# EAGLE design SleepLiteRev3 (EAGLE 6.2)
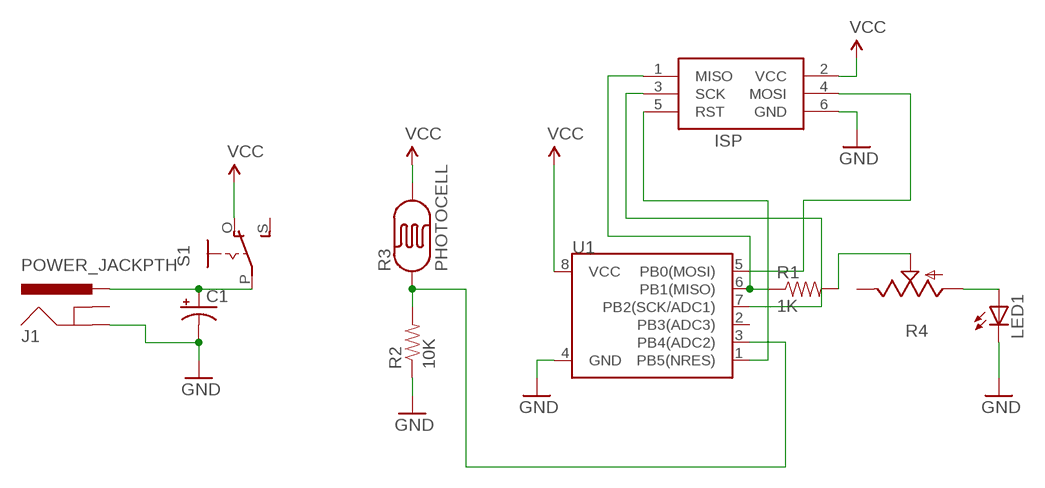
[diagram p0: schematic, sheet 1]

## Parts
C1  CAP_POLPTH2  [CPOL-RADIAL-10UF-25V]
ISP  AVRISP-6  [AVRISP]
J1  POWER_JACKPTH  [POWER_JACK_PTH]
LED1  LED5MM  [LED5MM]
R1  1K  RESISTORPTH-1/4W  [AXIAL-0.4]
R2  10K  RESISTORPTH-1/4W  [AXIAL-0.4]
R3  PHOTOCELL  PHOTOCELLPTH-KIT  [PHOTOCELL-KIT]
R4  TRIM_US-B64Y  [B64Y]
S1  EG1218S  [EG1218]
U1  ATTINY13DIP  [DIP08]

## Nets
GND: C1.2(-) ISP.6(GND) J1.GND LED1.K(C) R2.P$1 U1.4(GND)
N$1: C1.1(+) J1.PWR S1.P
N$2: R2.P$2 R3.1 U1.3(PB4(ADC2))
N$3: ISP.1(MISO) R1.P$1 U1.6(PB1(MISO))
N$4: R1.P$2 R4.S
N$5: LED1.A R4.A
N$6: ISP.5(RST) U1.1(PB5(NRES))
N$7: ISP.4(MOSI) U1.5(PB0(MOSI))
N$9: ISP.3(SCK) U1.7(PB2(SCK/ADC1))
VCC: ISP.2(VCC) R3.2 S1.O U1.8(VCC)
Unconnected: J1.GNDBREAK R4.E S1.S U1.2(PB3(ADC3))

## Library data of the parts
C1 = SparkFun-Passives:CAP_POL: Capacitor Polarized These are standard SMD and PTH capacitors. Normally 10uF, 47uF, and 100uF in electrolytic and tantalum varieties. Always verify the external diameter of the through hole cap, it varies with capacity, voltage, and manufacturer. The EIA devices should be standard.
ISP = adafruit:AVRISP: AVR ISP HEADER Standard 6 pin header for AVR programming
J1 = SparkFun-Connectors:POWER_JACK: Power Jack This is the standard 5.5mm barrel jack for power. The PTH is the most common, proven, reliable, footprint. All others are experimental. The Slot footprint only works if the mill layer is transmitted to the PCB fab house so be warned. Spark Fun Electronics SKU : PRT-00119. Mating wall wart : TOL-00298 (and others)
LED1 = led:LED: LED OSRAM: - CHIPLED LG R971, LG N971, LY N971, LG Q971, LY Q971, LO R971, LY R971 LH N974, LH R974 LS Q976, LO Q976, LY Q976 LO Q996 - Hyper CHIPLED LW Q18S LB Q993, LB Q99A, LB R99A - SideLED LS A670, LO A670, LY A670, LG A670, LP A670 LB A673, LV A673, LT A673, LW A673 LH A674 LY A675 LS A676, LA A676, LO A676, LY A676, LW A676 LS A679, LY A679, LG A679 - Hyper Micro SIDELED® LS Y876, LA Y876, LO Y876, LY Y876 LT Y87S - SmartLED LW L88C, LW L88S LB L89C, LB L89S, LG L890 LS L89K, LO L89K, LY L89K LS L896, LA L896, LO L896, LY L896 - TOPLED LS T670, LO T670, LY T670, LG T670, LP T670 LSG T670, LSP T670, LSY T670, LOP T670, LYG T670 LG T671, LOG T671, LSG T671 LB T673, LV T673, LT T673, LW T673 LH T674 LS T676, LA T676, LO T676, LY T676, LB T676, LH T676, LSB T676, LW T676 LB T67C, LV T67C, LT T67C, LS T67K, LO T67K, LY T67K, LW E67C LS E67B, LA E67B, LO E67B, LY E67B, LB E67C, LV E67C, LT E67C LW T67C LS T679, LY T679, LG T679 LS T770, LO T770, LY T770, LG T770, LP T770 LB T773, LV T773, LT T773, LW T773 LH T774 LS E675, LA E675, LY E675, LS T675 LS T776, LA T776, LO T776, LY T776, LB T776 LHGB T686 LT T68C, LB T68C - Hyper Mini TOPLED® LB M676 - Mini TOPLED Santana® LG M470 LS M47K, LO M47K, LY M47K Source: http://www.osram.convergy.de LUXEON: - LUMILED® LXK2-PW12-R00, LXK2-PW12-S00, LXK2-PW14-U00, LXK2-PW14-V00 LXK2-PM12-R00, LXK2-PM12-S00, LXK2-PM14-U00 LXK2-PE12-Q00, LXK2-PE12-R00, LXK2-PE12-S00, LXK2-PE14-T00, LXK2-PE14-U00 LXK2-PB12-K00, LXK2-PB12-L00, LXK2-PB12-M00, LXK2-PB14-N00, LXK2-PB14-P00, LXK2-PB14-Q00 LXK2-PR12-L00, LXK2-PR12-M00, LXK2-PR14-Q00, LXK2-PR14-R00 LXK2-PD12-Q00, LXK2-PD12-R00, LXK2-PD12-S00 LXK2-PH12-R00, LXK2-PH12-S00 LXK2-PL12-P00, LXK2-PL12-Q00, LXK2-PL12-R00 Source: www.luxeon.com KINGBRIGHT: KA-3528ASYC Source: www.kingbright.com
R1 R2 = SparkFun-Passives:RESISTOR: Resistor Basic schematic elements and footprints for 0603, 1206, and PTH resistors.
R3 = SparkFun-Sensors:PHOTOCELL: CdS photoresistor. This is a low cost way to detect light levels. Resistance decreases with more incoming light. SparkFun SKU: SEN-09088
R4 = pot:TRIM_US-: POTENTIOMETER
S1 = adafruit:EG1218: SLIDING SWITCH 0.1" spacing through hole, vertical SPDT slide switch http://www.ladyada.net/library/pcb/eaglelibrary.html
U1 = SparkFun-DigitalIC:ATTINY13: Atmel 8-pin 1kB flash uC

## Board
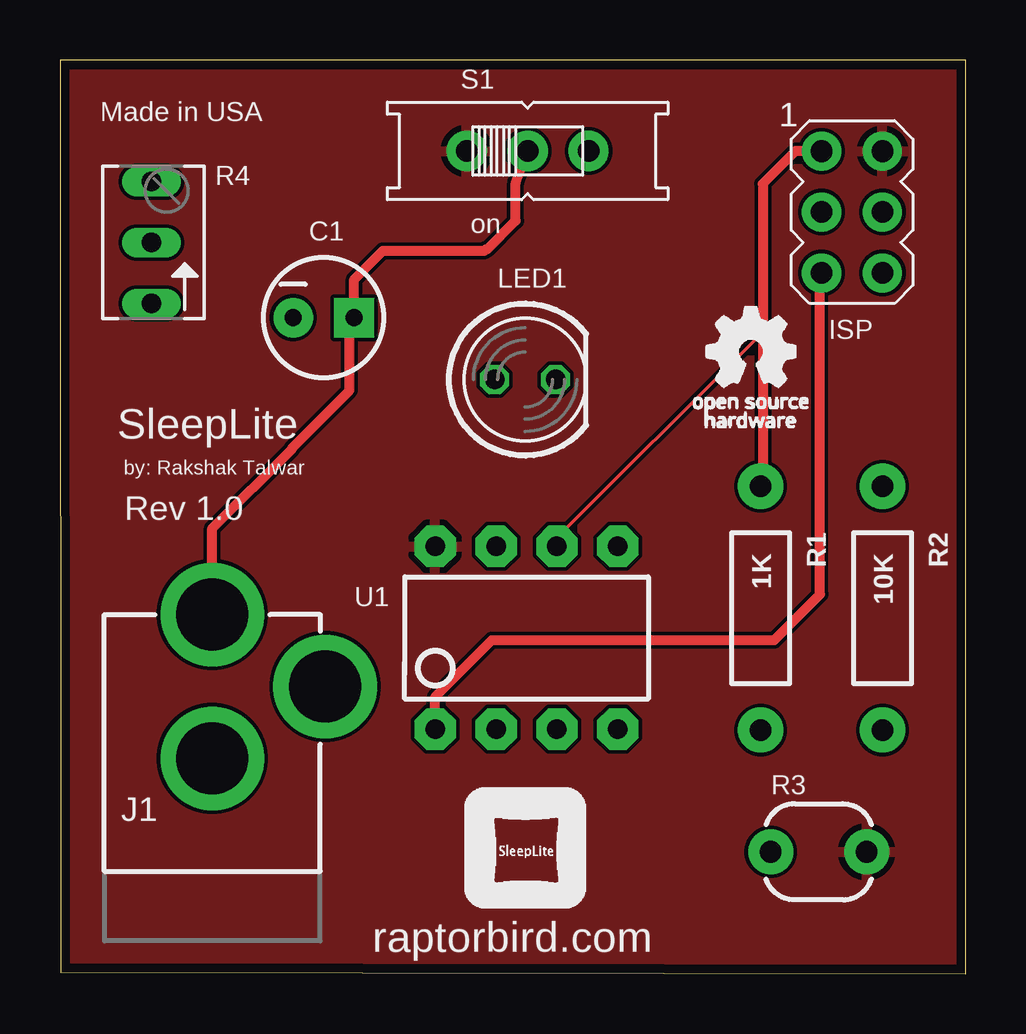
[diagram p1: board, top side]
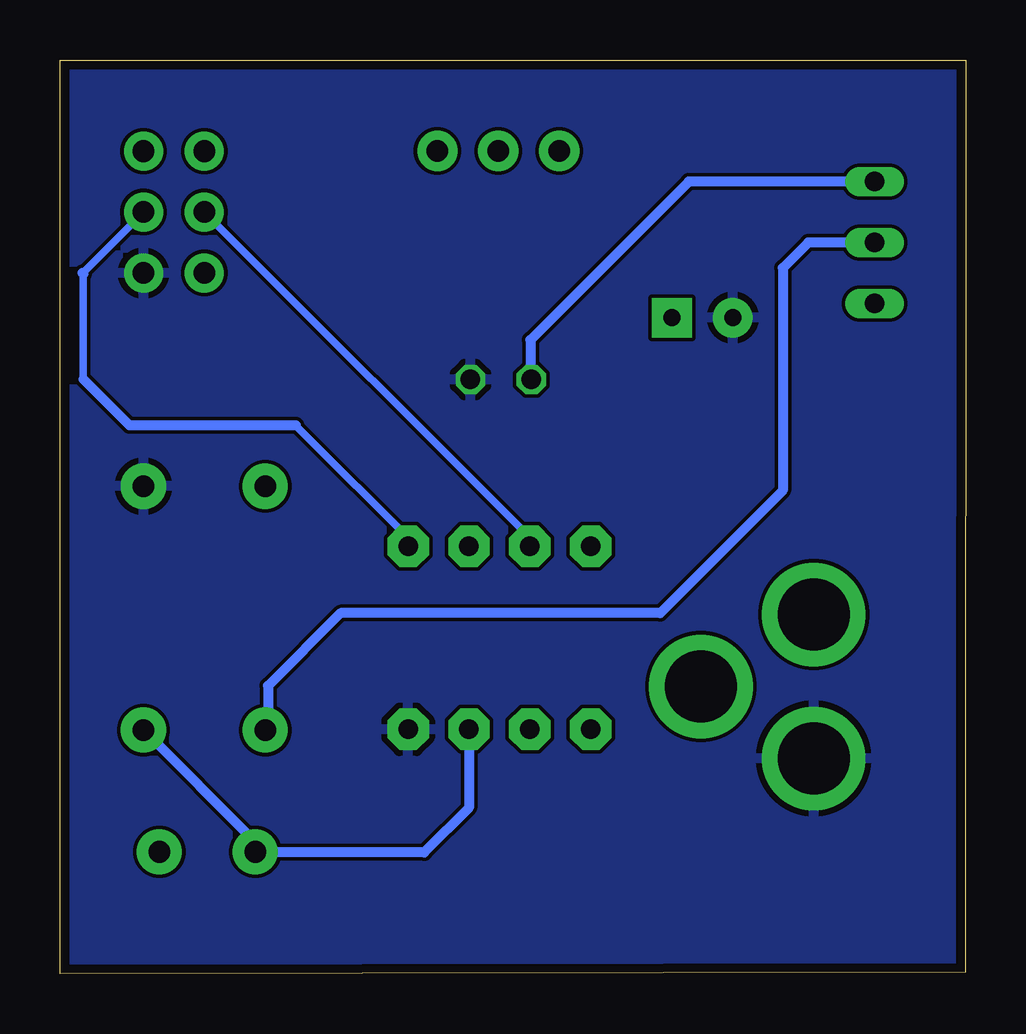
[diagram p2: board, bottom side, seen from below]

Size 37.77 x 38.09 mm. Coordinates in mm from the lower left corner, seen from the top.
Outline: 0.03,0.06 37.77,0 37.77,38.09 0,38.09 0.03,0.06
Copper layers (1*16): Top 0.0356mm / dielectric 1.5011mm / Bottom 0.0356mm
Design rules: minimum track width 6mil, minimum drill 13mil, track to track 6mil, track to pad 6mil, pad to pad 6mil, via to via 6mil, smd to smd 6mil, copper to edge 15mil, drill to drill 6mil, minimum pad ring 7mil, minimum via ring 7mil, stop-mask expansion 4mil, vias tented up to drill 0mil, thermal gap 10mil

### Footprints (pad centres in the part's own frame; a part is rotated, then mirrored left to right if it is on the bottom)
CPOL-RADIAL-10UF-25V = drill 0.7 pad 1.651 square: 1 1.27,0 | drill 0.7 pad 1.651: 2 -1.27,0
AVRISP = drill 0.9 pad 1.626: 1 -1.27,2.54; 2 1.27,2.54; 3 -1.27,0; 4 1.27,0; 5 -1.27,-2.54; 6 1.27,-2.54
POWER_JACK_PTH = drill 2.997 pad 4.318: GND 0,7.7; GNDBREAK 4.7,10.7; PWR 0,13.7
LED5MM = drill 0.813 octagon: A -1.27,0; K 1.27,0
AXIAL-0.4 = drill 0.9 pad 1.88: P$1 -5.08,0; P$2 5.08,0
PHOTOCELL-KIT = drill 0.9 pad 1.88: 1 -2,0; 2 2,0
B64Y = drill 0.813 long: A 2.54,0; E -2.54,0; S 0,0
EG1218 = drill 0.9 pad 1.676: O -2.54,0; P 0,0; S 2.54,0
DIP08 = drill 0.813 pad 1.727 octagon: 1 -3.81,-3.81; 2 -1.27,-3.81; 3 1.27,-3.81; 4 3.81,-3.81; 5 3.81,3.81; 6 1.27,3.81; 7 -1.27,3.81; 8 -3.81,3.81

### Placement (x,y rotation side)
C1  10.99,27.35 0 top
ISP  33.02,31.75 0 top
J1  [POWER_JACK_PTH]  6.35,1.27 0 top
LED1  19.39,24.77 0 top
R1  29.21,15.24 270 top
R2  34.29,15.24 270 top
R3  31.63,5.08 0 top
R4  3.81,30.48 90 top
S1  19.5,34.3 0 top
U1  ATTINY85  [DIP08]  19.45,14 0 top

### Tracks (layer width: path | path; a pad name or v marks a point on that pad's centre or on a via)
GND
  pour Bottom: -0.56,38.78 38.78,38.78 38.78,-0.51 -0.83,-0.51 -0.83,38.34
N$1
  Top 0.406: C1.1 12.26,28.93 13.46,30.13 17.68,30.13 17.74,30.19 17.8,30.19 18.99,31.38 18.99,32.96 S1.P | J1.PWR 6.35,18.56 9.69,21.9 9.69,21.93 12.07,24.31 12.07,27.15 C1.1 | 12.12,27.21 C1.1
  Bottom 0.406: 12.18,27.27 C1.1
N$2
  Bottom 0.406: U1.3 20.72,6.92 22.59,5.05 29.6,5.05 R3.1 29.63,5.5 R2.P$2
N$3
  Top 0.152: U1.6 20.32,17.78 29.21,26.67 29.3,26.67
  Top 0.406: ISP.1 30.66,34.29 29.3,32.93 29.3,26.67 29.3,21.07 29.24,21.01 29.24,20.35 R1.P$1
N$4
  Bottom 0.406: R4.S 6.58,30.48 7.64,29.42 7.64,20.15 12.75,15.04 26.06,15.04 29.09,12.01 29.09,10.28 R1.P$2
N$5
  Bottom 0.406: R4.A 11.56,33.02 18.16,26.42 18.16,24.57 LED1.A
N$6
  Top 0.406: 31.77,29.19 ISP.5 31.68,29.14 31.68,15.81 29.78,13.91 18.01,13.91 15.64,11.54 U1.1
N$7
  Bottom 0.152: 22.86,17.78 U1.5
  Bottom 0.305: 36.83,29.21 ISP.4 | 22.86,17.78 27.94,22.86 | 36.79,24.79 36.79,29.17
  Bottom 0.406: 27.94,22.86 34.87,22.86 36.79,24.79 | 36.79,29.17 36.83,29.21
N$9
  Top 0.406: 31.62,31.62 ISP.3
  Bottom 0.152: 17.78,17.78 U1.7
  Bottom 0.305: 17.78,17.78 ISP.3
VCC
  pour Top: -0.71,34.98 -0.71,38.69 39.2,38.69 39.2,-0.27 -0.92,-0.27 -0.92,32.39

### Text on the board
tPlace: Made in USA | on | SleepLite | by: Rakshak Talwar | Rev 1.0 | raptorbird.com